# Altium project LFR_circularbot_NUVOLA_V1.PrjPcb
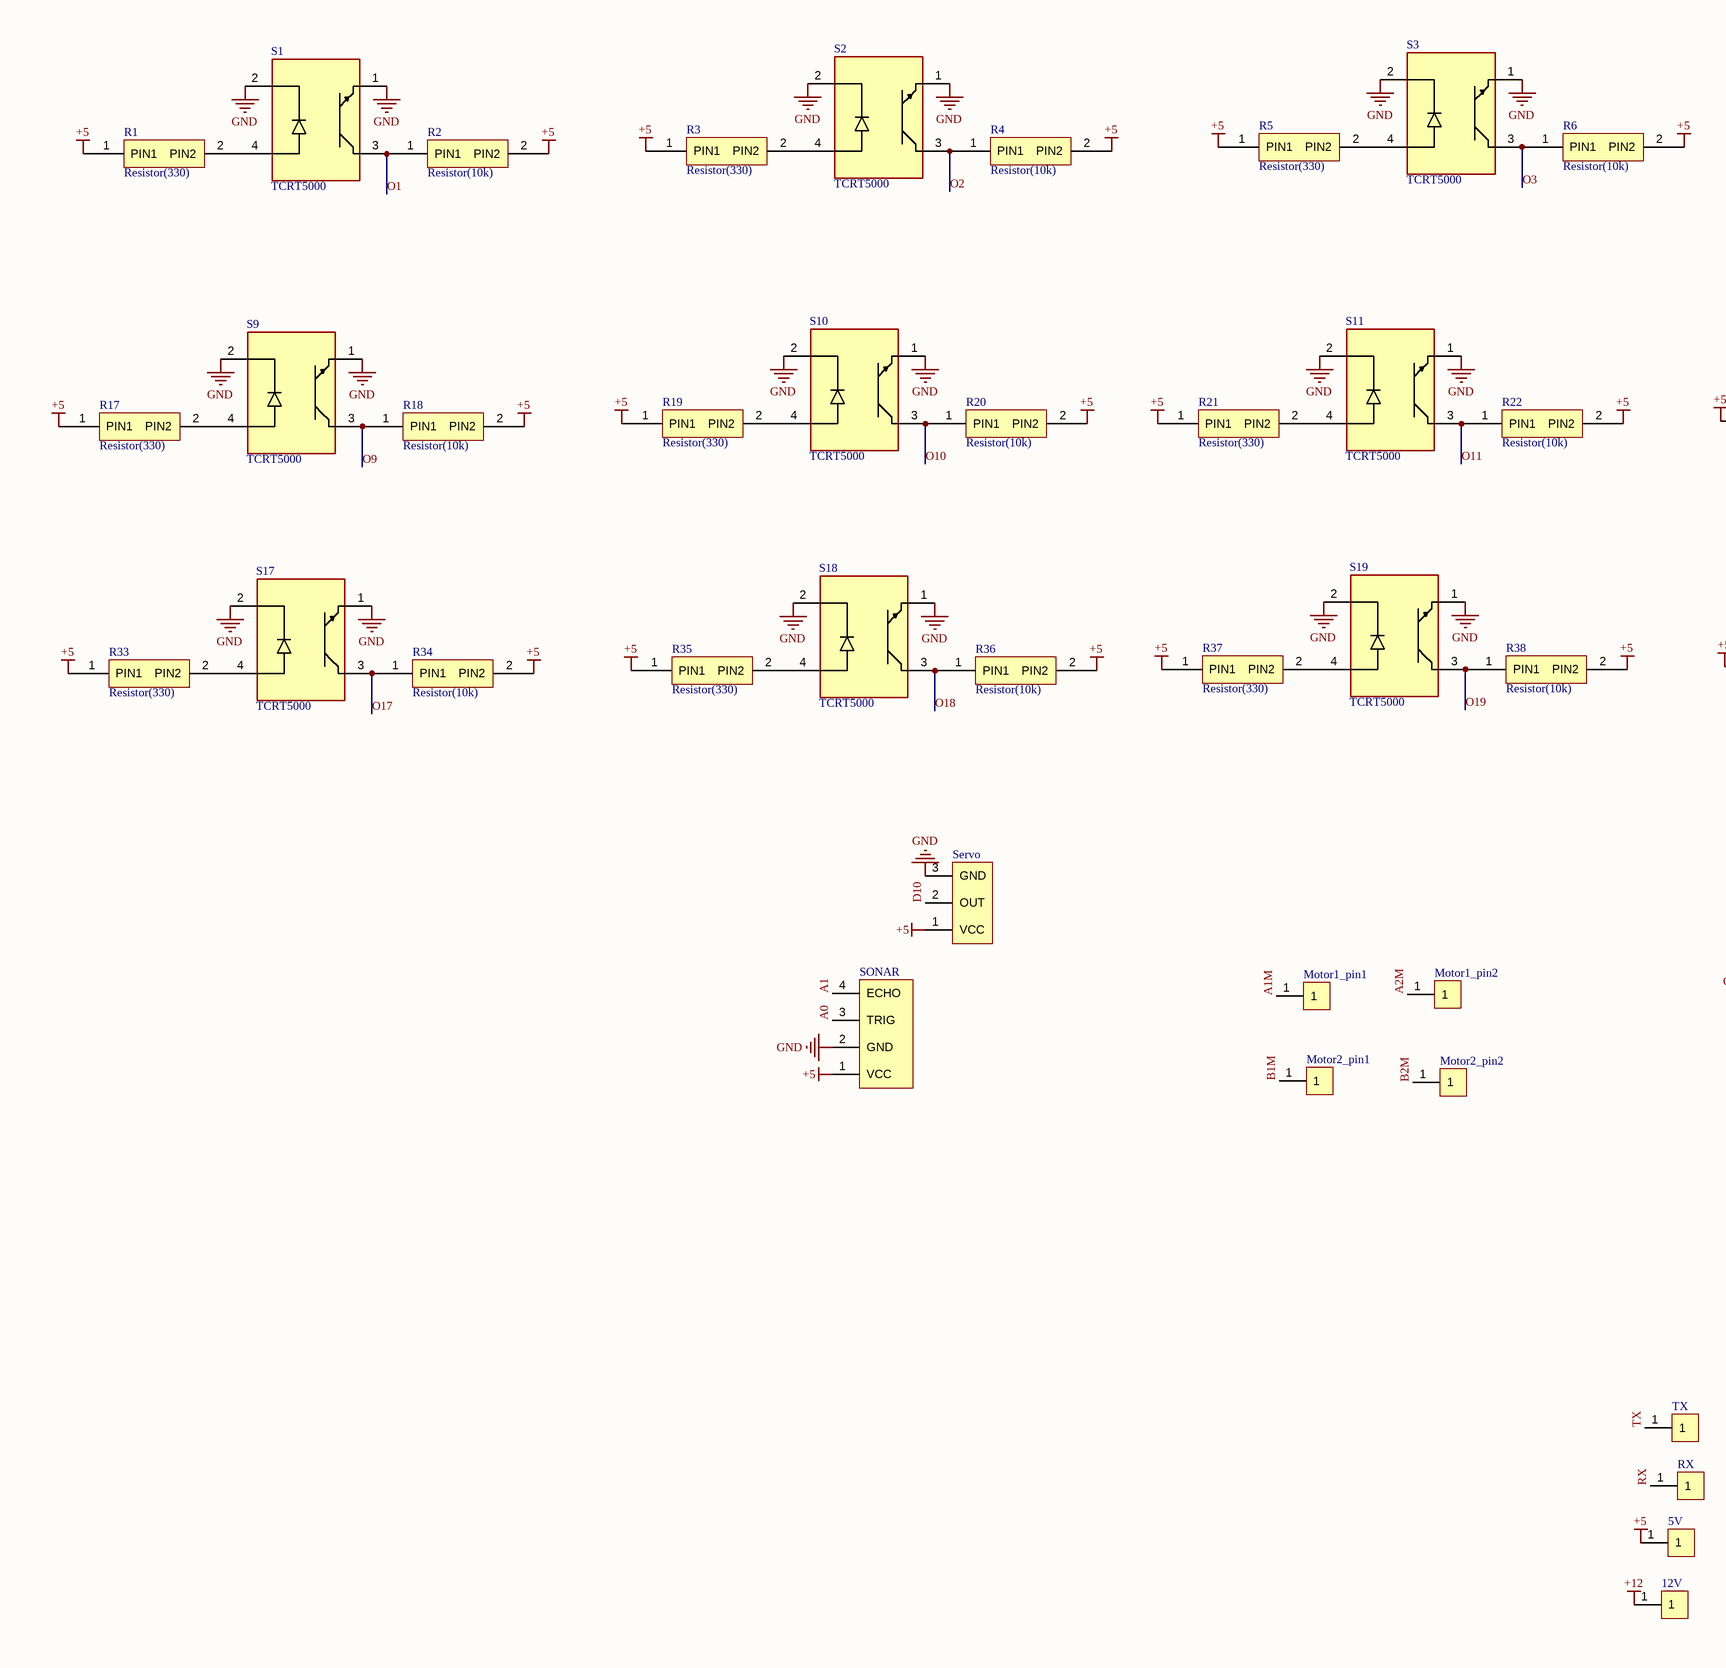
[diagram p0: Sheet1.SchDoc, left]
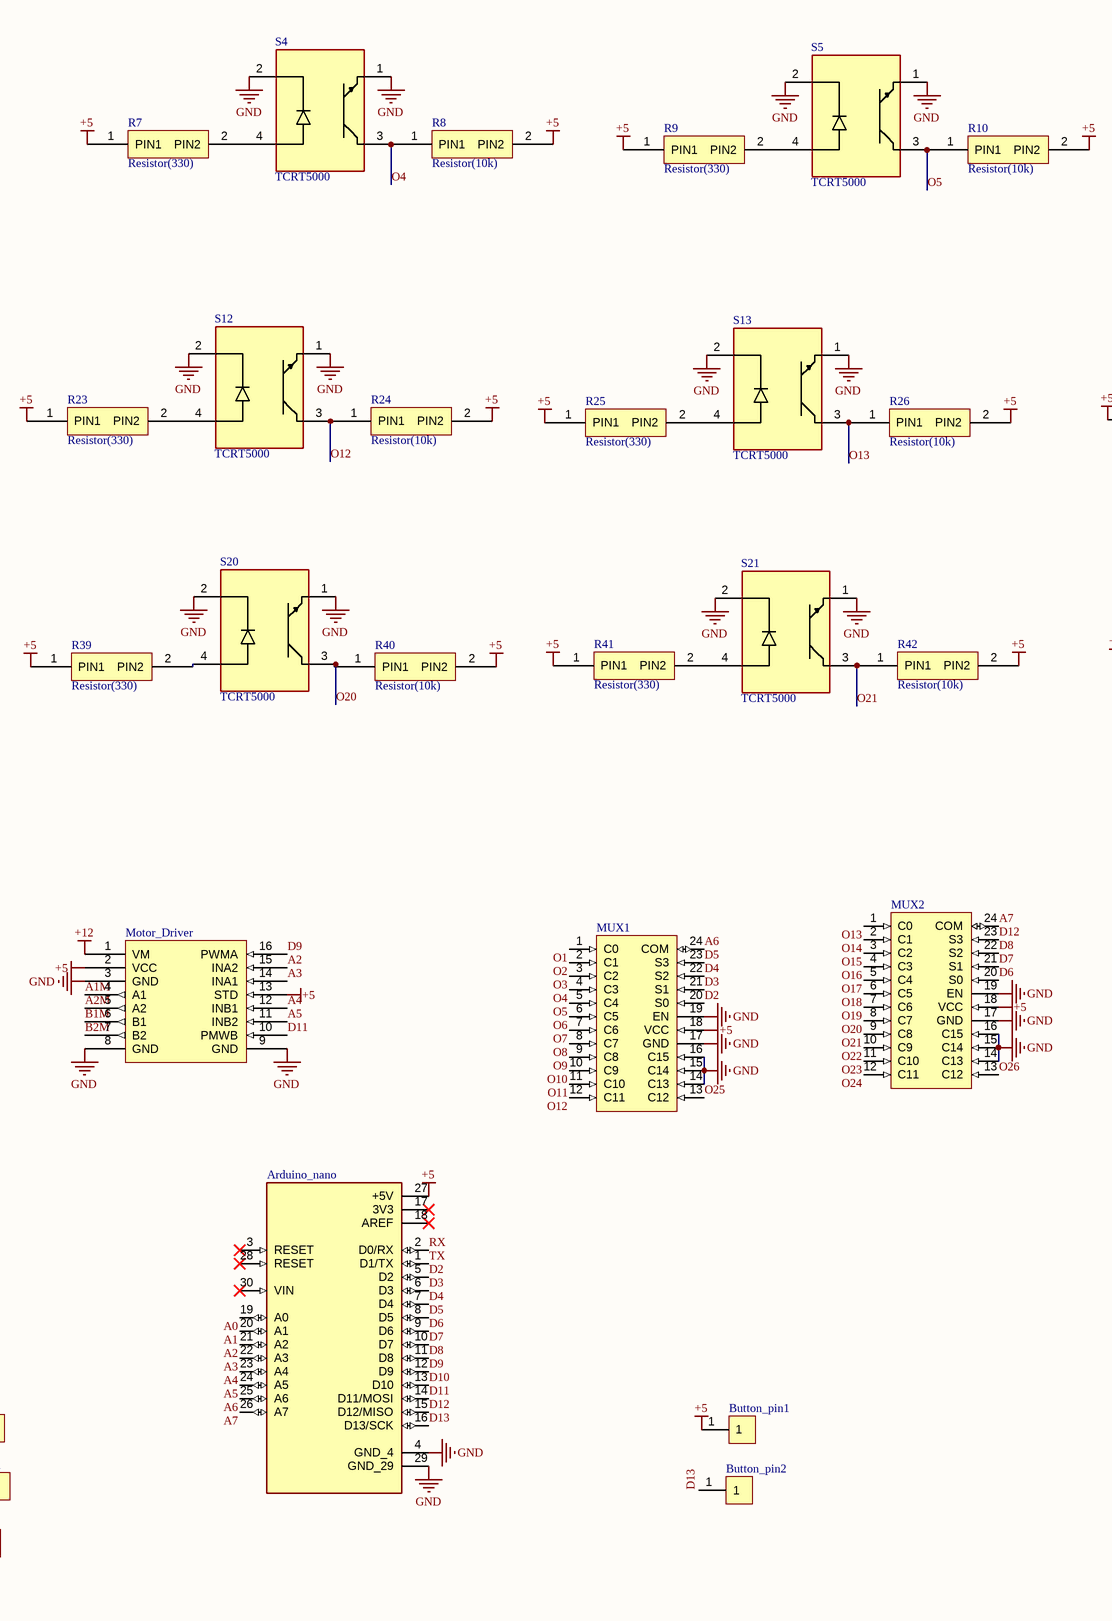
[diagram p1: Sheet1.SchDoc, middle]
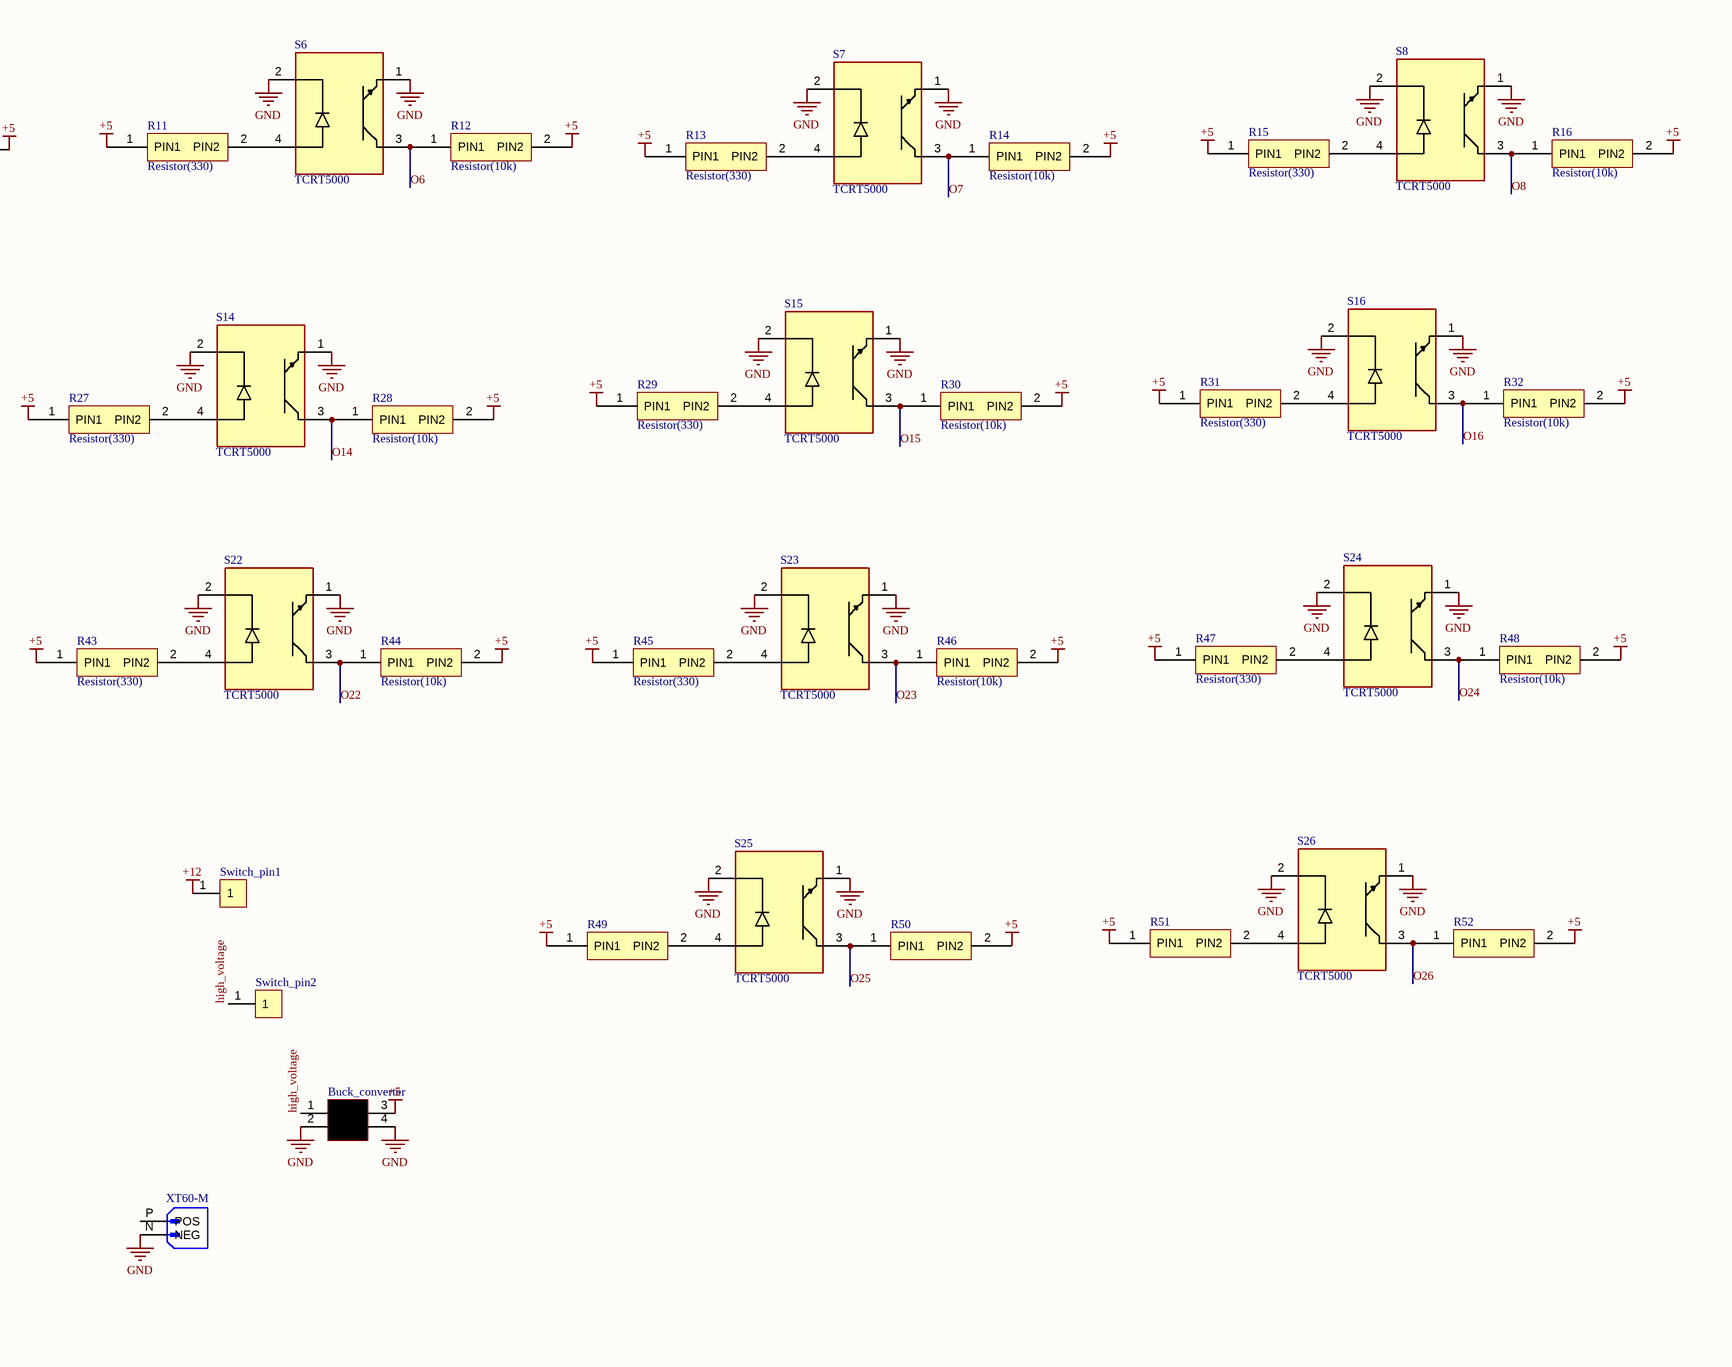
[diagram p2: Sheet1.SchDoc, right]
1 sheet, 98 parts. Net scope: global (net labels, ports and power ports of the same name join across sheets).
Board file: PCB1.PcbDoc

## Sheet Sheet1.SchDoc
size 863 x 558 mm; SheetNumber: 1; SheetTotal: 1

### Parts
5V  (no value)  [1_pin_male_header]
12V  (no value)  [1_pin_male_header]
Arduino_nano  (no value)  [Arduino_nano]
Buck_converter  (no value)  [Buck_converter]
Button_pin1  (no value)  [1_pin_female_header]
Button_pin2  (no value)  [1_pin_female_header]
Motor1_pin1  (no value)  [1_pin_male_header]
Motor1_pin2  (no value)  [1_pin_male_header]
Motor2_pin1  (no value)  [1_pin_male_header]
Motor2_pin2  (no value)  [1_pin_male_header]
Motor_Driver  (no value)  [TB6612_Motor_driver]
MUX1  (no value)  [MUX]
MUX2  (no value)  [MUX]
R1  Resistor(330)  [Resistor(330)]
R2  Resistor(10k)  [Resistor(10k)]
R3  Resistor(330)  [Resistor(330)]
R4  Resistor(10k)  [Resistor(10k)]
R5  Resistor(330)  [Resistor(330)]
R6  Resistor(10k)  [Resistor(10k)]
R7  Resistor(330)  [Resistor(330)]
R8  Resistor(10k)  [Resistor(10k)]
R9  Resistor(330)  [Resistor(330)]
R10  Resistor(10k)  [Resistor(10k)]
R11  Resistor(330)  [Resistor(330)]
R12  Resistor(10k)  [Resistor(10k)]
R13  Resistor(330)  [Resistor(330)]
R14  Resistor(10k)  [Resistor(10k)]
R15  Resistor(330)  [Resistor(330)]
R16  Resistor(10k)  [Resistor(10k)]
R17  Resistor(330)  [Resistor(330)]
R18  Resistor(10k)  [Resistor(10k)]
R19  Resistor(330)  [Resistor(330)]
R20  Resistor(10k)  [Resistor(10k)]
R21  Resistor(330)  [Resistor(330)]
R22  Resistor(10k)  [Resistor(10k)]
R23  Resistor(330)  [Resistor(330)]
R24  Resistor(10k)  [Resistor(10k)]
R25  Resistor(330)  [Resistor(330)]
R26  Resistor(10k)  [Resistor(10k)]
R27  Resistor(330)  [Resistor(330)]
R28  Resistor(10k)  [Resistor(10k)]
R29  Resistor(330)  [Resistor(330)]
R30  Resistor(10k)  [Resistor(10k)]
R31  Resistor(330)  [Resistor(330)]
R32  Resistor(10k)  [Resistor(10k)]
R33  Resistor(330)  [Resistor(330)]
R34  Resistor(10k)  [Resistor(10k)]
R35  Resistor(330)  [Resistor(330)]
R36  Resistor(10k)  [Resistor(10k)]
R37  Resistor(330)  [Resistor(330)]
R38  Resistor(10k)  [Resistor(10k)]
R39  Resistor(330)  [Resistor(330)]
R40  Resistor(10k)  [Resistor(10k)]
R41  Resistor(330)  [Resistor(330)]
R42  Resistor(10k)  [Resistor(10k)]
R43  Resistor(330)  [Resistor(330)]
R44  Resistor(10k)  [Resistor(10k)]
R45  Resistor(330)  [Resistor(330)]
R46  Resistor(10k)  [Resistor(10k)]
R47  Resistor(330)  [Resistor(330)]
R48  Resistor(10k)  [Resistor(10k)]
R49  (no value)  [Resistor(330)]
R50  (no value)  [Resistor(10k)]
R51  (no value)  [Resistor(330)]
R52  (no value)  [Resistor(10k)]
RX  (no value)  [1_pin_male_header]
S1  TCRT5000  [TCRT5000]
S2  TCRT5000  [TCRT5000]
S3  TCRT5000  [TCRT5000]
S4  TCRT5000  [TCRT5000]
S5  TCRT5000  [TCRT5000]
S6  TCRT5000  [TCRT5000]
S7  TCRT5000  [TCRT5000]
S8  TCRT5000  [TCRT5000]
S9  TCRT5000  [TCRT5000]
S10  TCRT5000  [TCRT5000]
S11  TCRT5000  [TCRT5000]
S12  TCRT5000  [TCRT5000]
S13  TCRT5000  [TCRT5000]
S14  TCRT5000  [TCRT5000]
S15  TCRT5000  [TCRT5000]
S16  TCRT5000  [TCRT5000]
S17  TCRT5000  [TCRT5000]
S18  TCRT5000  [TCRT5000]
S19  TCRT5000  [TCRT5000]
S20  TCRT5000  [TCRT5000]
S21  TCRT5000  [TCRT5000]
S22  TCRT5000  [TCRT5000]
S23  TCRT5000  [TCRT5000]
S24  TCRT5000  [TCRT5000]
S25  TCRT5000  [TCRT5000]
S26  TCRT5000  [TCRT5000]
Servo  (no value)  [3_pin_male_header]
SONAR  (no value)  [4 pin male]
Switch_pin1  (no value)  [1_pin_male_header]
Switch_pin2  (no value)  [1_pin_male_header]
TX  (no value)  [1_pin_male_header]
XT60-M  (no value)  [AMASS_XT60-M]

### Nets
+5: 5V.1 Arduino_nano.27(+5V) Buck_converter.3 Button_pin1.1 Motor_Driver.2(VCC) Motor_Driver.13(STD) MUX1.18(VCC) MUX2.18(VCC) R1.1(PIN1) R2.2(PIN2) R3.1(PIN1) R4.2(PIN2) R5.1(PIN1) R6.2(PIN2) R7.1(PIN1) R8.2(PIN2) R9.1(PIN1) R10.2(PIN2) R11.1(PIN1) R12.2(PIN2) R13.1(PIN1) R14.2(PIN2) R15.1(PIN1) R16.2(PIN2) R17.1(PIN1) R18.2(PIN2) R19.1(PIN1) R20.2(PIN2) R21.1(PIN1) R22.2(PIN2) R23.1(PIN1) R24.2(PIN2) R25.1(PIN1) R26.2(PIN2) R27.1(PIN1) R28.2(PIN2) R29.1(PIN1) R30.2(PIN2) R31.1(PIN1) R32.2(PIN2) R33.1(PIN1) R34.2(PIN2) R35.1(PIN1) R36.2(PIN2) R37.1(PIN1) R38.2(PIN2) R39.1(PIN1) R40.2(PIN2) R41.1(PIN1) R42.2(PIN2) R43.1(PIN1) R44.2(PIN2) R45.1(PIN1) R46.2(PIN2) R47.1(PIN1) R48.2(PIN2) R49.1(PIN1) R50.2(PIN2) R51.1(PIN1) R52.2(PIN2) Servo.1(VCC) SONAR.1(VCC)
+12: 12V.1 Motor_Driver.1(VM) Switch_pin1.1
GND: Arduino_nano.4(GND_4) Arduino_nano.29(GND_29) Buck_converter.2 Buck_converter.4 Motor_Driver.3(GND) Motor_Driver.8(GND) Motor_Driver.9(GND) MUX1.14(C13) MUX1.15(C14) MUX1.16(C15) MUX1.17(GND) MUX1.19(EN) MUX2.14(C13) MUX2.15(C14) MUX2.16(C15) MUX2.17(GND) MUX2.19(EN) S1.1(emmiter) S1.2(cathode) S2.1(emmiter) S2.2(cathode) S3.1(emmiter) S3.2(cathode) S4.1(emmiter) S4.2(cathode) S5.1(emmiter) S5.2(cathode) S6.1(emmiter) S6.2(cathode) S7.1(emmiter) S7.2(cathode) S8.1(emmiter) S8.2(cathode) S9.1(emmiter) S9.2(cathode) S10.1(emmiter) S10.2(cathode) S11.1(emmiter) S11.2(cathode) S12.1(emmiter) S12.2(cathode) S13.1(emmiter) S13.2(cathode) S14.1(emmiter) S14.2(cathode) S15.1(emmiter) S15.2(cathode) S16.1(emmiter) S16.2(cathode) S17.1(emmiter) S17.2(cathode) S18.1(emmiter) S18.2(cathode) S19.1(emmiter) S19.2(cathode) S20.1(emmiter) S20.2(cathode) S21.1(emmiter) S21.2(cathode) S22.1(emmiter) S22.2(cathode) S23.1(emmiter) S23.2(cathode) S24.1(emmiter) S24.2(cathode) S25.1(emmiter) S25.2(cathode) S26.1(emmiter) S26.2(cathode) Servo.3(GND) SONAR.2(GND) XT60-M.N(NEG)
A0: Arduino_nano.19(A0) SONAR.3(TRIG)
A1: Arduino_nano.20(A1) SONAR.4(ECHO)
A1M: Motor1_pin1.1 Motor_Driver.4(A1)
A2: Arduino_nano.21(A2) Motor_Driver.15(INA2)
A2M: Motor1_pin2.1 Motor_Driver.5(A2)
A3: Arduino_nano.22(A3) Motor_Driver.14(INA1)
A4: Arduino_nano.23(A4) Motor_Driver.12(INB1)
A5: Arduino_nano.24(A5) Motor_Driver.11(INB2)
A6: Arduino_nano.25(A6) MUX1.24(COM)
A7: Arduino_nano.26(A7) MUX2.24(COM)
B1M: Motor2_pin1.1 Motor_Driver.6(B1)
B2M: Motor2_pin2.1 Motor_Driver.7(B2)
D2: Arduino_nano.5(D2) MUX1.20(S0)
D3: Arduino_nano.6(D3) MUX1.21(S1)
D4: Arduino_nano.7(D4) MUX1.22(S2)
D5: Arduino_nano.8(D5) MUX1.23(S3)
D6: Arduino_nano.9(D6) MUX2.20(S0)
D7: Arduino_nano.10(D7) MUX2.21(S1)
D8: Arduino_nano.11(D8) MUX2.22(S2)
D9: Arduino_nano.12(D9) Motor_Driver.16(PWMA)
D10: Arduino_nano.13(D10) Servo.2(OUT)
D11: Arduino_nano.14(D11/MOSI) Motor_Driver.10(PMWB)
D12: Arduino_nano.15(D12/MISO) MUX2.23(S3)
D13: Arduino_nano.16(D13/SCK) Button_pin2.1
high_voltage: Buck_converter.1 Switch_pin2.1
O1: MUX1.1(C0) R2.1(PIN1) S1.3(collector)
O2: MUX1.2(C1) R4.1(PIN1) S2.3(collector)
O3: MUX1.3(C2) R6.1(PIN1) S3.3(collector)
O4: MUX1.4(C3) R8.1(PIN1) S4.3(collector)
O5: MUX1.5(C4) R10.1(PIN1) S5.3(collector)
O6: MUX1.6(C5) R12.1(PIN1) S6.3(collector)
O7: MUX1.7(C6) R14.1(PIN1) S7.3(collector)
O8: MUX1.8(C7) R16.1(PIN1) S8.3(collector)
O9: MUX1.9(C8) R18.1(PIN1) S9.3(collector)
O10: MUX1.10(C9) R20.1(PIN1) S10.3(collector)
O11: MUX1.11(C10) R22.1(PIN1) S11.3(collector)
O12: MUX1.12(C11) R24.1(PIN1) S12.3(collector)
O13: MUX2.1(C0) R26.1(PIN1) S13.3(collector)
O14: MUX2.2(C1) R28.1(PIN1) S14.3(collector)
O15: MUX2.3(C2) R30.1(PIN1) S15.3(collector)
O16: MUX2.4(C3) R32.1(PIN1) S16.3(collector)
O17: MUX2.5(C4) R34.1(PIN1) S17.3(collector)
O18: MUX2.6(C5) R36.1(PIN1) S18.3(collector)
O19: MUX2.7(C6) R38.1(PIN1) S19.3(collector)
O20: MUX2.8(C7) R40.1(PIN1) S20.3(collector)
O21: MUX2.9(C8) R42.1(PIN1) S21.3(collector)
O22: MUX2.10(C9) R44.1(PIN1) S22.3(collector)
O23: MUX2.11(C10) R46.1(PIN1) S23.3(collector)
O24: MUX2.12(C11) R48.1(PIN1) S24.3(collector)
O25: MUX1.13(C12) R50.1(PIN1) S25.3(collector)
O26: MUX2.13(C12) R52.1(PIN1) S26.3(collector)
RX: Arduino_nano.2(D0/RX) RX.1
TX: Arduino_nano.1(D1/TX) TX.1
NetR1_2: R1.2(PIN2) S1.4(anode)
NetR3_2: R3.2(PIN2) S2.4(anode)
NetR5_2: R5.2(PIN2) S3.4(anode)
NetR7_2: R7.2(PIN2) S4.4(anode)
NetR9_2: R9.2(PIN2) S5.4(anode)
NetR11_2: R11.2(PIN2) S6.4(anode)
NetR13_2: R13.2(PIN2) S7.4(anode)
NetR15_2: R15.2(PIN2) S8.4(anode)
NetR17_2: R17.2(PIN2) S9.4(anode)
NetR19_2: R19.2(PIN2) S10.4(anode)
NetR21_2: R21.2(PIN2) S11.4(anode)
NetR23_2: R23.2(PIN2) S12.4(anode)
NetR25_2: R25.2(PIN2) S13.4(anode)
NetR27_2: R27.2(PIN2) S14.4(anode)
NetR29_2: R29.2(PIN2) S15.4(anode)
NetR31_2: R31.2(PIN2) S16.4(anode)
NetR33_2: R33.2(PIN2) S17.4(anode)
NetR35_2: R35.2(PIN2) S18.4(anode)
NetR37_2: R37.2(PIN2) S19.4(anode)
NetR39_2: R39.2(PIN2) S20.4(anode)
NetR41_2: R41.2(PIN2) S21.4(anode)
NetR43_2: R43.2(PIN2) S22.4(anode)
NetR45_2: R45.2(PIN2) S23.4(anode)
NetR47_2: R47.2(PIN2) S24.4(anode)
NetR49_2: R49.2(PIN2) S25.4(anode)
NetR51_2: R51.2(PIN2) S26.4(anode)

Not connected (* = marked no-connect by the designer): Arduino_nano 3(RESET)* 17(3V3)* 18(AREF)* 28(RESET)* 30(VIN)*; XT60-M P(POS)

### Notes on the sheet
- DWG. NO.
- REV.
- SHT.
- REVISION
- DESCRIPTION
- DATE
- APPROVED
- THIS DOCUMENT AND THE DATA DISCLOSED HEREIN OR HEREWITH IS THE PROPERTY OF ALTIUM LIMITED AND MAY BE FREELY DISTRIBUTED IN WHOLE. NO RIGHTS ARE RESERVED OR EXPRESS OR IMPLIED WARANTEE GIVEN.
- ENG:
- DSN:
- APPROVALS
- PROJECT
- DOCUMENT REVISION:
- DESIGN ITEM:
- CHK:
- BOM:
- REFERENCE DOCUMENTS
- PROJECT REVISION:
- TITLE
- FAB DWG:
- PCB DWG:
- ASSY DWG:
- SCALE:
- SIZE
- D
- CAGE CODE
- FILE NAME
- DWG NO.
- SHEET
- OF
- REV

### Library data of the parts
5V 12V Motor1_pin1 Motor1_pin2 Motor2_pin1 Motor2_pin2 RX Switch_pin1 Switch_pin2 TX = 1_pin_male_header
Arduino_nano = Arduino_nano
Buck_converter = Buck_converter
Button_pin1 Button_pin2 = 1_pin_female_header
Motor_Driver = TB6612_Motor_driver
MUX1 MUX2 = MUX
R49 R51 = Resistor(330)
R50 R52 = Resistor(10k)
Servo = 3_pin_male_header
SONAR = 4 pin male
XT60-M = XT60-M: Plug; DC supply; XT60; male; PIN: 2; for cable; soldered; 30A; 500V; MF: AMASS; SnapEDA_Link: https://www.snapeda.com/parts/XT60-M/AMASS/view-part/?ref=snap; Package: Package; Value: *; MP: XT60-M; Check_prices: https://www.snapeda.com/parts/XT60-M/AMASS/view-part/?ref=eda